# EAGLE schematic keyboard (EAGLE 6.5.0)
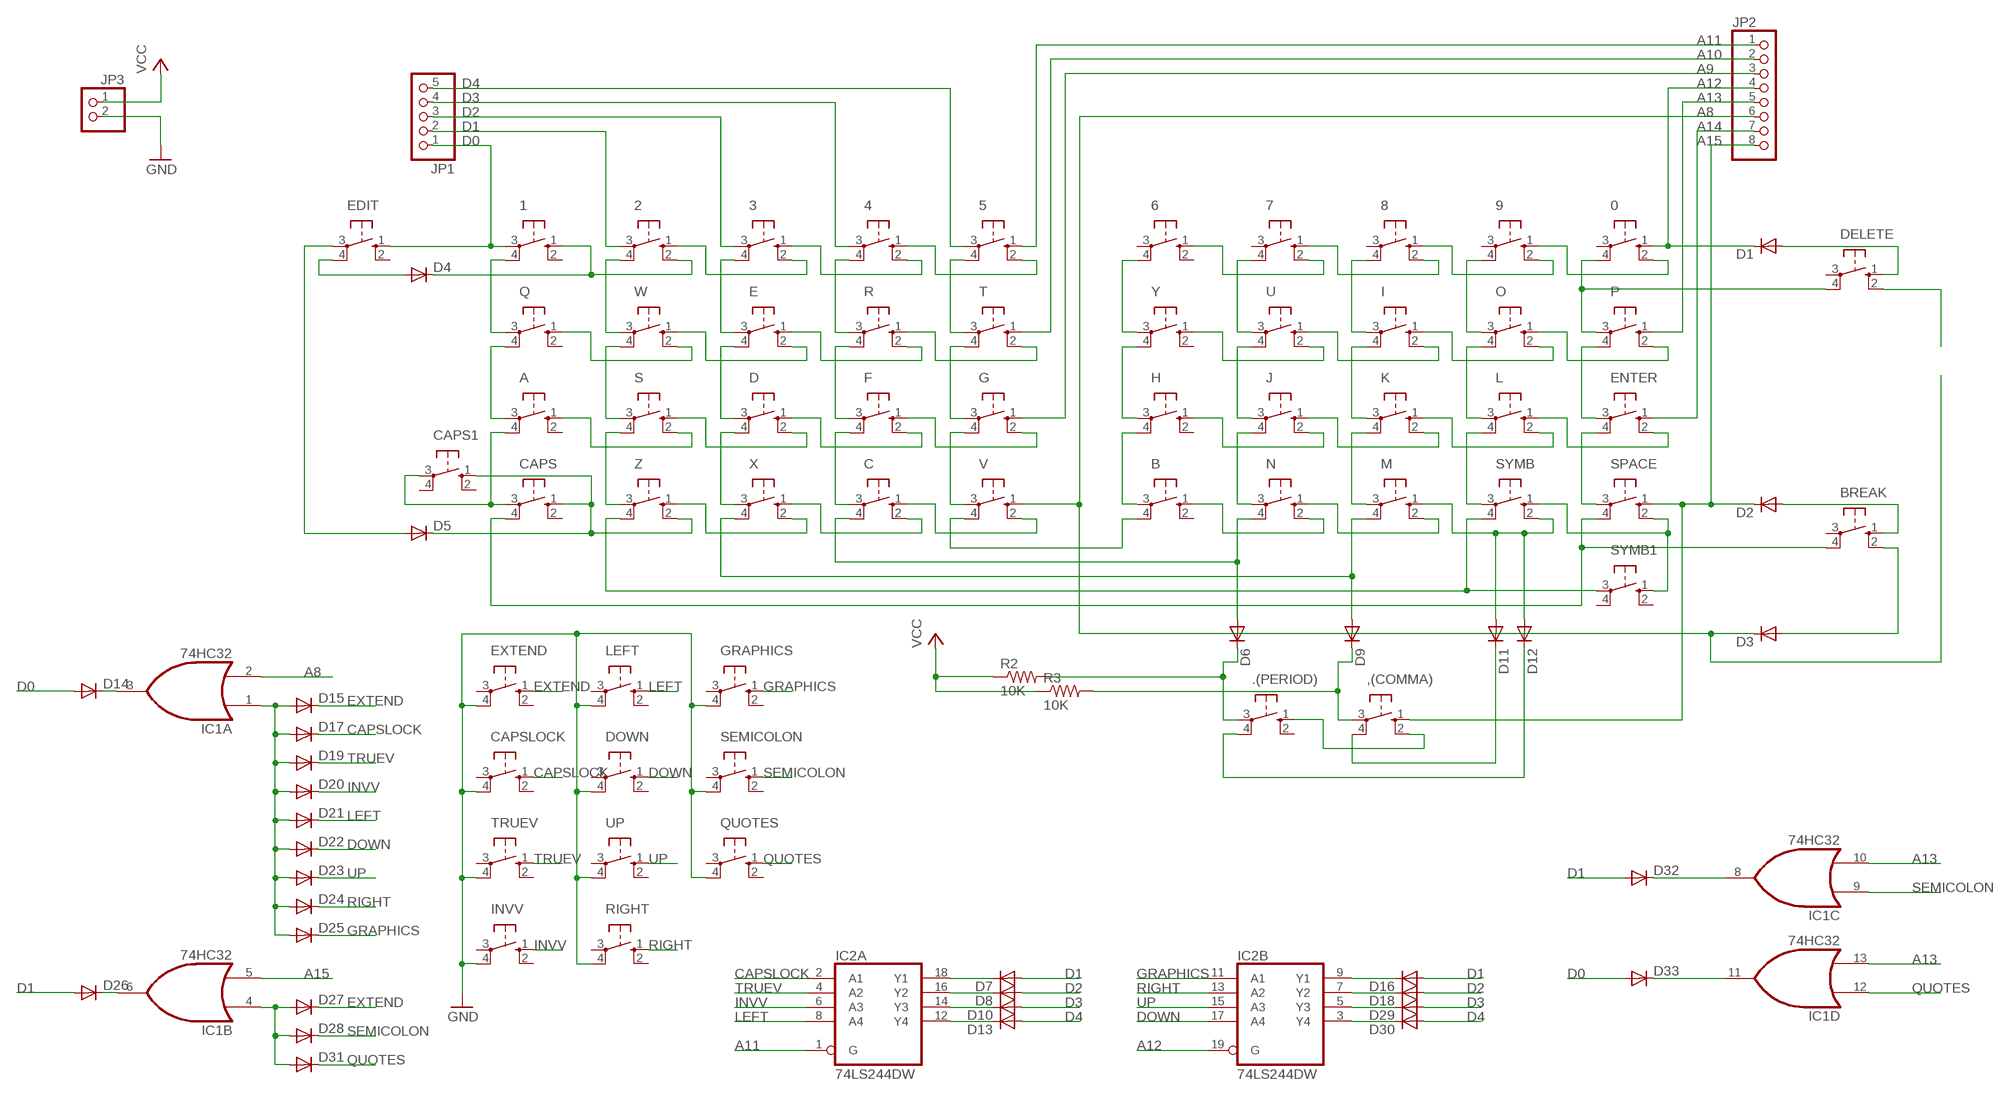
[diagram p0: schematic, sheet 1]

## Parts
0  40-XX  [B3F-40XX]
1  40-XX  [B3F-40XX]
2  40-XX  [B3F-40XX]
3  40-XX  [B3F-40XX]
4  40-XX  [B3F-40XX]
5  40-XX  [B3F-40XX]
6  40-XX  [B3F-40XX]
7  40-XX  [B3F-40XX]
8  40-XX  [B3F-40XX]
9  40-XX  [B3F-40XX]
,(COMMA)  40-XX  [B3F-40XX]
.(PERIOD)  40-XX  [B3F-40XX]
A  40-XX  [B3F-40XX]
B  40-XX  [B3F-40XX]
BREAK  40-XX  [B3F-40XX]
C  40-XX  [B3F-40XX]
CAPS  40-XX  [B3F-40XX]
CAPS1  40-XX  [B3F-40XX]
CAPSLOCK  40-XX  [B3F-40XX]
D  40-XX  [B3F-40XX]
D1  DIODE-SMC  [SMC]
D2  DIODE-SMC  [SMC]
D3  DIODE-SMC  [SMC]
D4  DIODE-SMC  [SMC]
D5  DIODE-SMC  [SMC]
D6  DIODE-SMC  [SMC]
D7  DIODE-SMC  [SMC]
D8  DIODE-SMC  [SMC]
D9  DIODE-SMC  [SMC]
D10  DIODE-SMC  [SMC]
D11  DIODE-SMC  [SMC]
D12  DIODE-SMC  [SMC]
D13  DIODE-SMC  [SMC]
D14  DIODE-SMC  [SMC]
D15  DIODE-SMC  [SMC]
D16  DIODE-SMC  [SMC]
D17  DIODE-SMC  [SMC]
D18  DIODE-SMC  [SMC]
D19  DIODE-SMC  [SMC]
D20  DIODE-SMC  [SMC]
D21  DIODE-SMC  [SMC]
D22  DIODE-SMC  [SMC]
D23  DIODE-SMC  [SMC]
D24  DIODE-SMC  [SMC]
D25  DIODE-SMC  [SMC]
D26  DIODE-SMC  [SMC]
D27  DIODE-SMC  [SMC]
D28  DIODE-SMC  [SMC]
D29  DIODE-SMC  [SMC]
D30  DIODE-SMC  [SMC]
D31  DIODE-SMC  [SMC]
D32  DIODE-SMC  [SMC]
D33  DIODE-SMC  [SMC]
DELETE  40-XX  [B3F-40XX]
DOWN  40-XX  [B3F-40XX]
E  40-XX  [B3F-40XX]
EDIT  40-XX  [B3F-40XX]
ENTER  40-XX  [B3F-40XX]
EXTEND  40-XX  [B3F-40XX]
F  40-XX  [B3F-40XX]
G  40-XX  [B3F-40XX]
GRAPHICS  40-XX  [B3F-40XX]
H  40-XX  [B3F-40XX]
I  40-XX  [B3F-40XX]
IC1  74HC32  74S32D  [SO14]
IC2  74LS244DW  [SO20W]
INVV  40-XX  [B3F-40XX]
J  40-XX  [B3F-40XX]
JP1  PINHD-1X5  [1X05]
JP2  PINHD-1X8  [1X08]
JP3  PINHD-1X2  [1X02]
K  40-XX  [B3F-40XX]
L  40-XX  [B3F-40XX]
LEFT  40-XX  [B3F-40XX]
M  40-XX  [B3F-40XX]
N  40-XX  [B3F-40XX]
O  40-XX  [B3F-40XX]
P  40-XX  [B3F-40XX]
Q  40-XX  [B3F-40XX]
QUOTES  40-XX  [B3F-40XX]
R  40-XX  [B3F-40XX]
R2  10K  R-US_M0805  [M0805]
R3  10K  R-US_M0805  [M0805]
RIGHT  40-XX  [B3F-40XX]
S  40-XX  [B3F-40XX]
SEMICOLON  40-XX  [B3F-40XX]
SPACE  40-XX  [B3F-40XX]
SYMB  40-XX  [B3F-40XX]
SYMB1  40-XX  [B3F-40XX]
T  40-XX  [B3F-40XX]
TRUEV  40-XX  [B3F-40XX]
U  40-XX  [B3F-40XX]
UP  40-XX  [B3F-40XX]
V  40-XX  [B3F-40XX]
W  40-XX  [B3F-40XX]
X  40-XX  [B3F-40XX]
Y  40-XX  [B3F-40XX]
Z  40-XX  [B3F-40XX]

## Nets
A8: D3.C IC1.2(A:I1) JP2.6 V.1(S)
A9: G.1(S) JP2.3
A10: JP2.2 T.1(S)
A11: 5.1(S) IC2.1(A:G) JP2.1
A12: 0.1(S) D1.C IC2.19(B:G) JP2.4
A13: IC1.10(C:I1) IC1.13(D:I1) JP2.5 P.1(S)
A14: ENTER.1(S) JP2.7
A15: ,(COMMA).1(S) D2.C IC1.5(B:I1) JP2.8 SPACE.1(S)
CAPSLOCK: CAPSLOCK.1(S) D17.C IC2.2(A:A1)
D0: 1.3(P) D14.A D33.A EDIT.1(S) JP1.1
D1: 2.3(P) D7.A D16.A D26.A D32.A JP1.2
D2: 3.3(P) D8.A D18.A JP1.3
D3: 4.3(P) D10.A D29.A JP1.4
D4: 5.3(P) D13.A D30.A JP1.5
DOWN: D22.C DOWN.1(S) IC2.17(B:A4)
EXTEND: D15.C D27.C EXTEND.1(S)
GND: CAPSLOCK.4(P1) DOWN.4(P1) EXTEND.4(P1) GRAPHICS.4(P1) INVV.4(P1) JP3.2 LEFT.4(P1) QUOTES.4(P1) RIGHT.4(P1) SEMICOLON.4(P1) TRUEV.4(P1) UP.4(P1)
GRAPHICS: D25.C GRAPHICS.1(S) IC2.11(B:A1)
INVV: D20.C IC2.6(A:A3) INVV.1(S)
LEFT: D21.C IC2.8(A:A4) LEFT.1(S)
N$1: D4.A EDIT.4(P1)
N$2: D5.A EDIT.3(P)
N$3: BREAK.1(S) D2.A
N$4: BREAK.2(S1) D3.A
N$5: D1.A DELETE.1(S)
N$6: 1.4(P1) Q.3(P)
N$7: A.3(P) Q.4(P1)
N$8: A.4(P1) CAPS1.3(P) CAPS.3(P)
N$9: BREAK.4(P1) CAPS.4(P1) SPACE.4(P1)
N$10: B.3(P) H.4(P1)
N$11: H.3(P) Y.4(P1)
N$12: 6.4(P1) Y.3(P)
N$13: 2.4(P1) W.3(P)
N$14: S.3(P) W.4(P1)
N$15: S.4(P1) Z.3(P)
N$16: SYMB1.3(P) SYMB.4(P1) Z.4(P1)
N$17: D9.A M.4(P1) X.4(P1)
N$18: C.4(P1) D6.A N.4(P1)
N$19: B.4(P1) V.4(P1)
N$20: 3.4(P1) E.3(P)
N$21: D.3(P) E.4(P1)
N$22: D.4(P1) X.3(P)
N$23: 4.4(P1) R.3(P)
N$24: F.3(P) R.4(P1)
N$25: C.3(P) F.4(P1)
N$26: 5.4(P1) T.3(P)
N$27: G.3(P) T.4(P1)
N$28: G.4(P1) V.3(P)
N$29: 3.1(S) 4.2(S1)
N$30: 4.1(S) 5.2(S1)
N$31: 2.1(S) 3.2(S1)
N$32: 1.1(S) 2.2(S1) D4.C
N$33: C.1(S) V.2(S1)
N$34: R.1(S) T.2(S1)
N$35: E.1(S) R.2(S1)
N$36: E.2(S1) W.1(S)
N$37: Q.1(S) W.2(S1)
N$38: F.1(S) G.2(S1)
N$39: D.1(S) F.2(S1)
N$40: D.2(S1) S.1(S)
N$41: A.1(S) S.2(S1)
N$42: 0.2(S1) 9.1(S)
N$43: J.4(P1) N.3(P)
N$44: J.3(P) U.4(P1)
N$45: 7.4(P1) U.3(P)
N$46: K.4(P1) M.3(P)
N$47: I.4(P1) K.3(P)
N$48: 8.4(P1) I.3(P)
N$49: L.4(P1) SYMB.3(P)
N$50: L.3(P) O.4(P1)
N$51: 9.4(P1) O.3(P)
N$52: ENTER.4(P1) SPACE.3(P)
N$53: ENTER.3(P) P.4(P1)
N$54: 0.4(P1) DELETE.4(P1) P.3(P)
N$55: 8.1(S) 9.2(S1)
N$56: 7.1(S) 8.2(S1)
N$57: 6.1(S) 7.2(S1)
N$58: C.2(S1) X.1(S)
N$59: X.2(S1) Z.1(S)
N$60: CAPS1.1(S) CAPS.1(S) D5.C Z.2(S1)
N$61: O.1(S) P.2(S1)
N$62: I.1(S) O.2(S1)
N$63: I.2(S1) U.1(S)
N$64: U.2(S1) Y.1(S)
N$65: ENTER.2(S1) L.1(S)
N$66: K.1(S) L.2(S1)
N$67: J.1(S) K.2(S1)
N$68: H.1(S) J.2(S1)
N$69: SPACE.2(S1) SYMB1.1(S) SYMB.1(S)
N$70: D11.A D12.A M.1(S) SYMB.2(S1)
N$71: M.2(S1) N.1(S)
N$72: B.1(S) N.2(S1)
N$73: DELETE.2(S1)
N$74: D7.C IC2.18(A:Y1)
N$75: D8.C IC2.16(A:Y2)
N$76: ,(COMMA).2(S1) .(PERIOD).1(S)
N$77: D10.C IC2.14(A:Y3)
N$78: ,(COMMA).4(P1) D11.C
N$79: .(PERIOD).4(P1) D12.C
N$80: D13.C IC2.12(A:Y4)
N$81: D16.C IC2.9(B:Y1)
N$82: .(PERIOD).3(P) D6.C R2.2
N$83: ,(COMMA).3(P) D9.C R3.2
N$84: D14.C IC1.3(A:O)
N$85: D18.C IC2.7(B:Y2)
N$86: D26.C IC1.6(B:O)
N$87: D27.A D28.A D31.A IC1.4(B:I0)
N$88: D29.C IC2.5(B:Y3)
N$89: D30.C IC2.3(B:Y4)
N$90: D15.A D17.A D19.A D20.A D21.A D22.A D23.A D24.A D25.A IC1.1(A:I0)
N$108: D32.C IC1.8(C:O)
N$114: D33.C IC1.11(D:O)
QUOTES: D31.C IC1.12(D:I0) QUOTES.1(S)
RIGHT: D24.C IC2.13(B:A2) RIGHT.1(S)
SEMICOLON: D28.C IC1.9(C:I0) SEMICOLON.1(S)
TRUEV: D19.C IC2.4(A:A2) TRUEV.1(S)
UP: D23.C IC2.15(B:A3) UP.1(S)
VCC: JP3.1 R2.1 R3.1
Unconnected: 0.3(P) 1.2(S1) 6.2(S1) 6.3(P) 7.3(P) 8.3(P) 9.3(P) .(PERIOD).2(S1) A.2(S1) B.2(S1) BREAK.3(P) CAPS1.2(S1) CAPS1.4(P1) CAPS.2(S1) CAPSLOCK.2(S1) CAPSLOCK.3(P) DELETE.3(P) DOWN.2(S1) DOWN.3(P) EDIT.2(S1) EXTEND.2(S1) EXTEND.3(P) GRAPHICS.2(S1) GRAPHICS.3(P) H.2(S1) INVV.2(S1) INVV.3(P) LEFT.2(S1) LEFT.3(P) Q.2(S1) QUOTES.2(S1) QUOTES.3(P) RIGHT.2(S1) RIGHT.3(P) SEMICOLON.2(S1) SEMICOLON.3(P) SYMB1.2(S1) SYMB1.4(P1) TRUEV.2(S1) TRUEV.3(P) UP.2(S1) UP.3(P) Y.2(S1)

## Power pins joined to a net without a drawn wire
GND: IC1.7(P:GND) IC2.10(P:GND)
VCC: IC1.14(P:VCC) IC2.20(P:VCC)

## Library data of the parts
0 1-9 ,(COMMA) .(PERIOD) A B BREAK C CAPS CAPS1 CAPSLOCK D DELETE DOWN E EDIT ENTER EXTEND F G GRAPHICS H I INVV J K L LEFT M N O P Q QUOTES R RIGHT S SEMICOLON SPACE SYMB SYMB1 T TRUEV U UP V W X Y Z = switch-omron:40-XX: OMRON SWITCH; MF: OMRON COMPONENTS USA; MPN: B3F-4000; OC_FARNELL: 176434; OC_NEWARK: 36K3105
D1-D33 = diode:DIODE-: DIODE
IC1 = 74xx-us:74*32: Quad 2-input OR gate
IC2 = 74xx-us:74*244: Octal BUFFER and LINE DRIVER, 3-state
JP1 = pinhead:PINHD-1X5: PIN HEADER
JP2 = pinhead:PINHD-1X8: PIN HEADER
JP3 = pinhead:PINHD-1X2: PIN HEADER
R2 R3 = rcl:R-US_: RESISTOR, American symbol